# EAGLE design Sample (EAGLE 9.6.2)
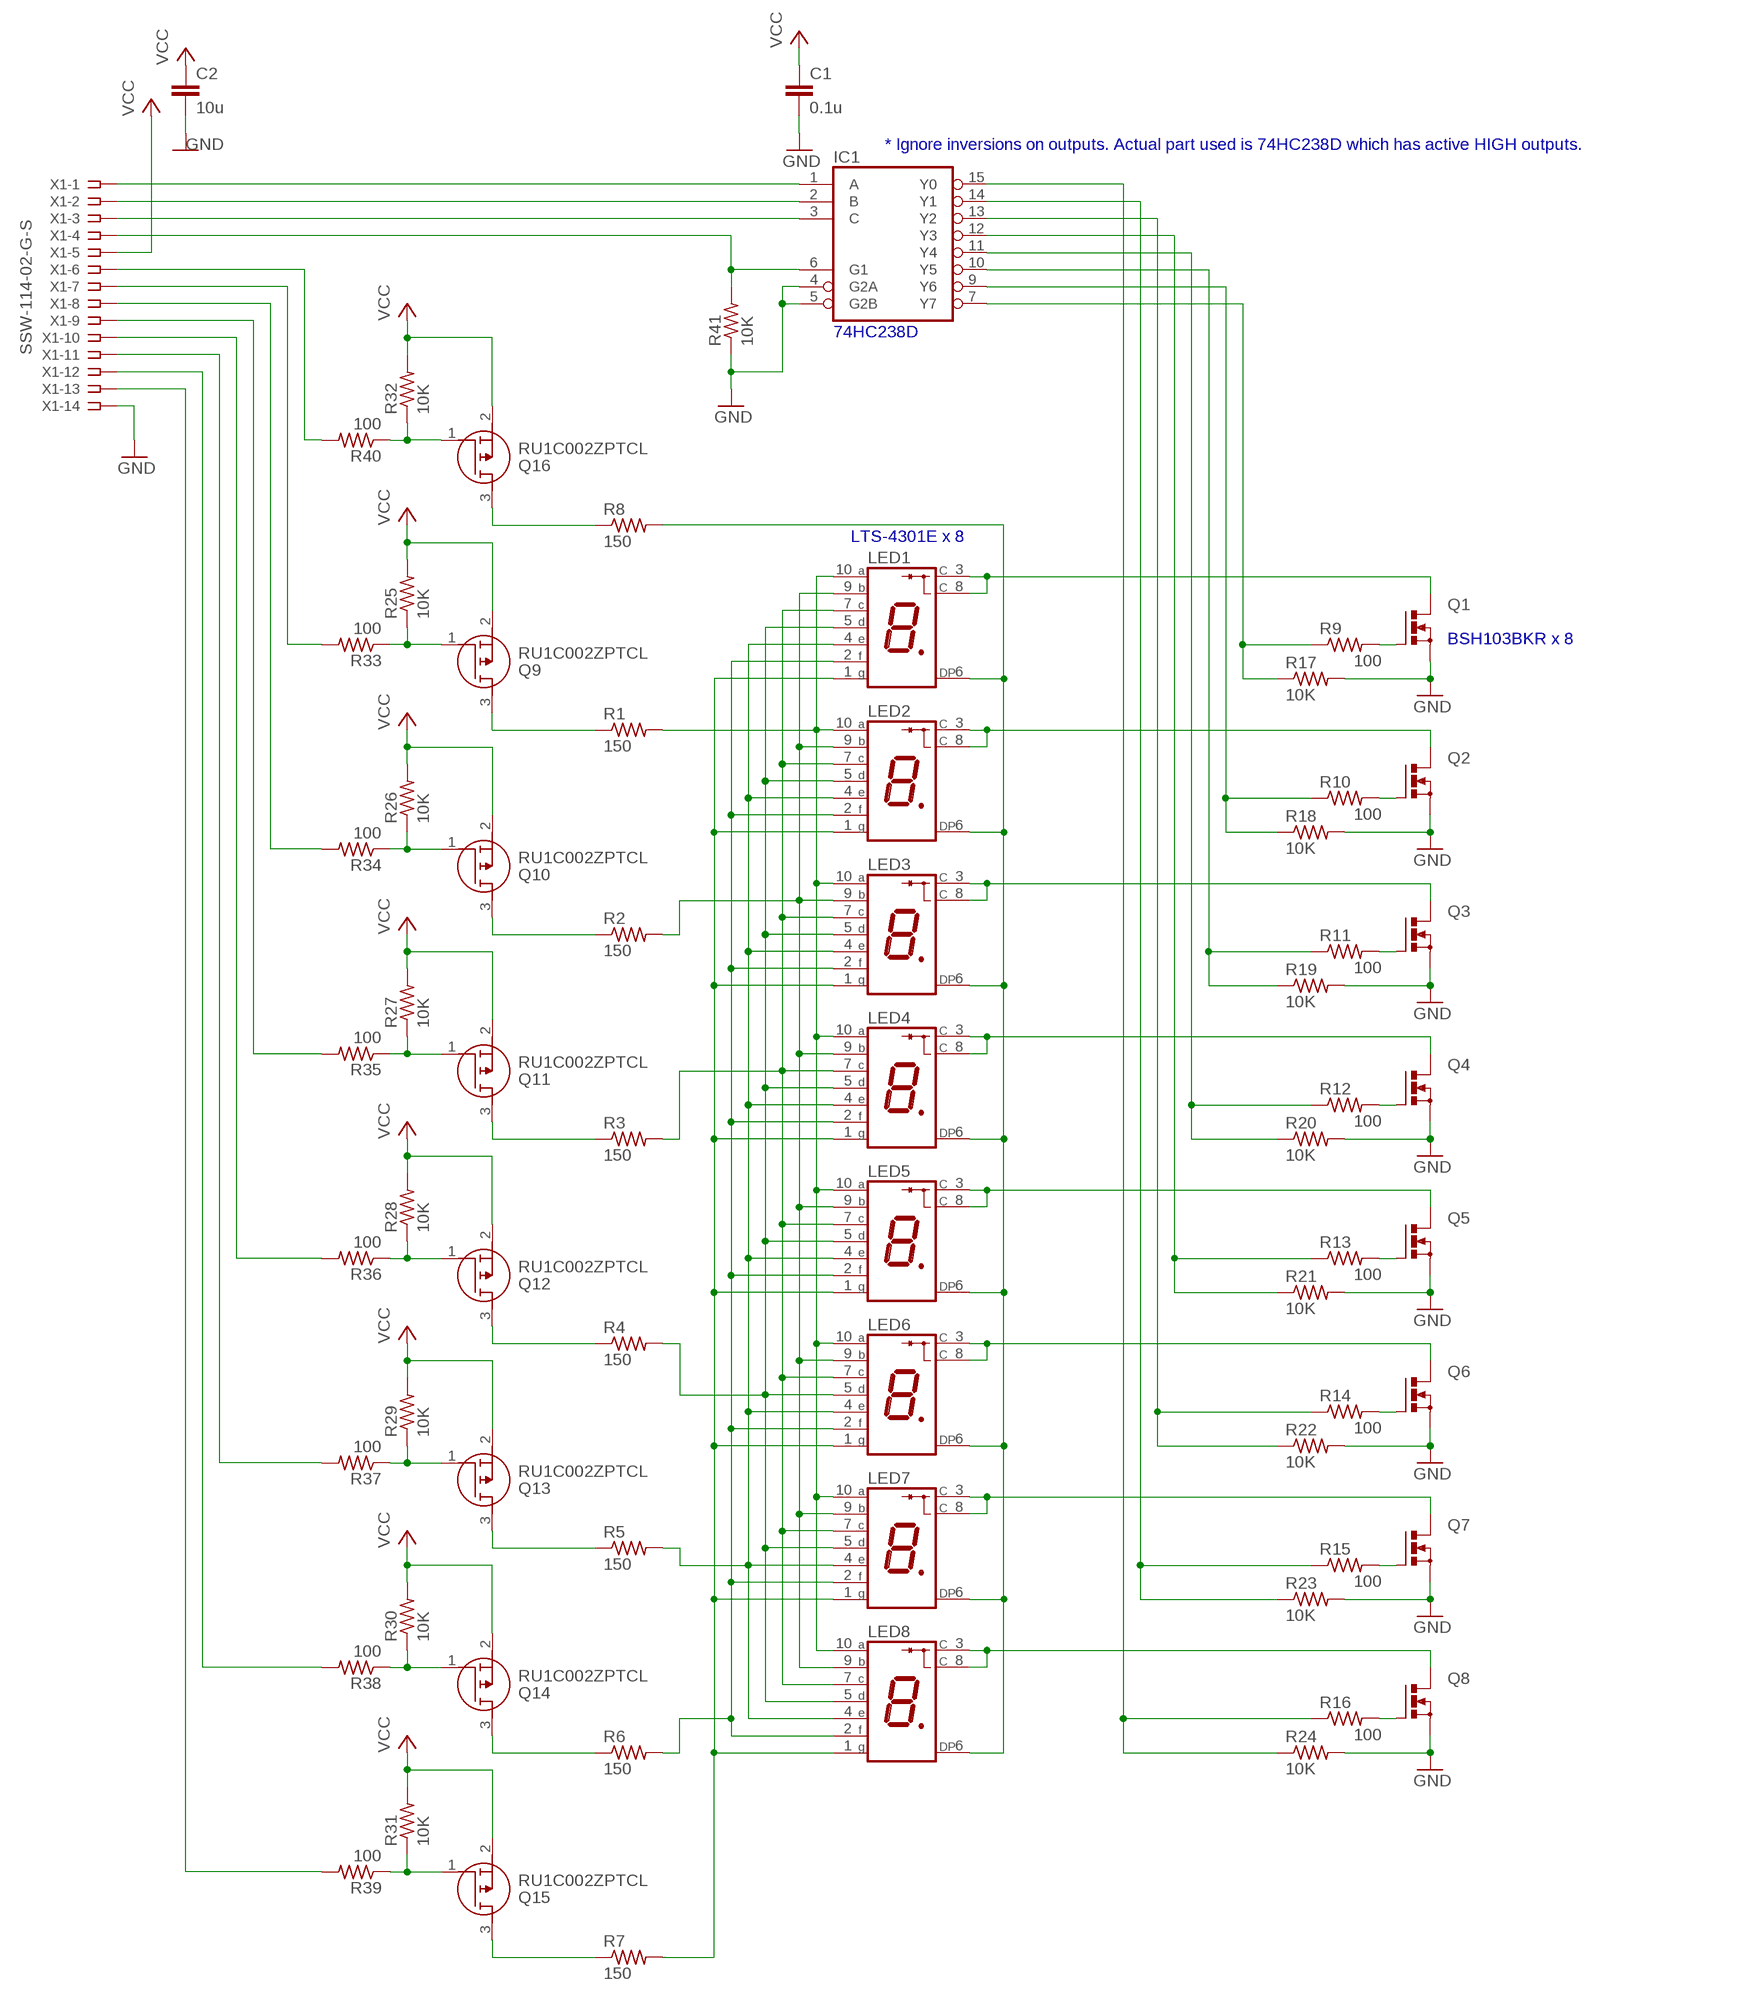
[diagram p0: schematic, sheet 1]

## Parts
C1  0.1u  C-EUC0805  [C0805]
C2  10u  C-EUC0805  [C0805]
IC1  74S138D  [SO16]
LED1  S4301B  [S4301B]
LED2  S4301B  [S4301B]
LED3  S4301B  [S4301B]
LED4  S4301B  [S4301B]
LED5  S4301B  [S4301B]
LED6  S4301B  [S4301B]
LED7  S4301B  [S4301B]
LED8  S4301B  [S4301B]
Q1  N-MOSFET-SO8  [SUPER-SOT3]
Q2  N-MOSFET-SO8  [SUPER-SOT3]
Q3  N-MOSFET-SO8  [SUPER-SOT3]
Q4  N-MOSFET-SO8  [SUPER-SOT3]
Q5  N-MOSFET-SO8  [SUPER-SOT3]
Q6  N-MOSFET-SO8  [SUPER-SOT3]
Q7  N-MOSFET-SO8  [SUPER-SOT3]
Q8  N-MOSFET-SO8  [SUPER-SOT3]
Q9  RU1C002ZPTCL  [SOTFL65P210X105-3N]
Q10  RU1C002ZPTCL  [SOTFL65P210X105-3N]
Q11  RU1C002ZPTCL  [SOTFL65P210X105-3N]
Q12  RU1C002ZPTCL  [SOTFL65P210X105-3N]
Q13  RU1C002ZPTCL  [SOTFL65P210X105-3N]
Q14  RU1C002ZPTCL  [SOTFL65P210X105-3N]
Q15  RU1C002ZPTCL  [SOTFL65P210X105-3N]
Q16  RU1C002ZPTCL  [SOTFL65P210X105-3N]
R1  150  R-US_R0805  [R0805]
R2  150  R-US_R0805  [R0805]
R3  150  R-US_R0805  [R0805]
R4  150  R-US_R0805  [R0805]
R5  150  R-US_R0805  [R0805]
R6  150  R-US_R0805  [R0805]
R7  150  R-US_R0805  [R0805]
R8  150  R-US_R0805  [R0805]
R9  100  R-US_R0805  [R0805]
R10  100  R-US_R0805  [R0805]
R11  100  R-US_R0805  [R0805]
R12  100  R-US_R0805  [R0805]
R13  100  R-US_R0805  [R0805]
R14  100  R-US_R0805  [R0805]
R15  100  R-US_R0805  [R0805]
R16  100  R-US_R0805  [R0805]
R17  10K  R-US_R0805  [R0805]
R18  10K  R-US_R0805  [R0805]
R19  10K  R-US_R0805  [R0805]
R20  10K  R-US_R0805  [R0805]
R21  10K  R-US_R0805  [R0805]
R22  10K  R-US_R0805  [R0805]
R23  10K  R-US_R0805  [R0805]
R24  10K  R-US_R0805  [R0805]
R25  10K  R-US_R0805  [R0805]
R26  10K  R-US_R0805  [R0805]
R27  10K  R-US_R0805  [R0805]
R28  10K  R-US_R0805  [R0805]
R29  10K  R-US_R0805  [R0805]
R30  10K  R-US_R0805  [R0805]
R31  10K  R-US_R0805  [R0805]
R32  10K  R-US_R0805  [R0805]
R33  100  R-US_R0805  [R0805]
R34  100  R-US_R0805  [R0805]
R35  100  R-US_R0805  [R0805]
R36  100  R-US_R0805  [R0805]
R37  100  R-US_R0805  [R0805]
R38  100  R-US_R0805  [R0805]
R39  100  R-US_R0805  [R0805]
R40  100  R-US_R0805  [R0805]
R41  10K  R-US_R0805  [R0805]
X1  SSW-114-02-G-S  [SSW-114-02-G-S]

## Nets
GND [LED_CURRENT]: C1.2 C2.2 IC1.4(G2A) IC1.5(G2B) Q1.2(S) Q2.2(S) Q3.2(S) Q4.2(S) Q5.2(S) Q6.2(S) Q7.2(S) Q8.2(S) R17.2 R18.2 R19.2 R20.2 R21.2 R22.2 R23.2 R24.2 R41.1 X1.14
LED_1_CATHODE [LED_CURRENT]: LED1.3(C) LED1.8(C) Q1.3(D)
LED_2_CATHODE [LED_CURRENT]: LED2.3(C) LED2.8(C) Q2.3(D)
LED_3_CATHODE [LED_CURRENT]: LED3.3(C) LED3.8(C) Q3.3(D)
LED_4_CATHODE [LED_CURRENT]: LED4.3(C) LED4.8(C) Q4.3(D)
LED_5_CATHODE [LED_CURRENT]: LED5.3(C) LED5.8(C) Q5.3(D)
LED_6_CATHODE [LED_CURRENT]: LED6.3(C) LED6.8(C) Q6.3(D)
LED_7_CATHODE [LED_CURRENT]: LED7.3(C) LED7.8(C) Q7.3(D)
LED_8_CATHODE [LED_CURRENT]: LED8.3(C) LED8.8(C) Q8.3(D)
N$1: Q1.1(G) R9.2
N$2: Q3.1(G) R11.2
N$3: Q5.1(G) R13.2
N$4: Q6.1(G) R14.2
N$5: Q7.1(G) R15.2
N$6: Q8.1(G) R16.2
N$7: Q2.1(G) R10.2
N$8: Q4.1(G) R12.2
N$9: IC1.6(G1) R41.2 X1.4
N$10: Q9.1(G) R25.1 R33.1
N$11: Q10.1(G) R26.1 R34.1
N$12: Q14.1(G) R30.1 R38.1
N$13: Q11.1(G) R27.1 R35.1
N$14: Q13.1(G) R29.1 R37.1
N$15: Q12.1(G) R28.1 R36.1
N$17: IC1.15(Y0) R16.1 R24.1
N$18: IC1.14(Y1) R15.1 R23.1
N$19: IC1.13(Y2) R14.1 R22.1
N$20: IC1.12(Y3) R13.1 R21.1
N$21: IC1.11(Y4) R12.1 R20.1
N$22: IC1.10(Y5) R11.1 R19.1
N$23: IC1.9(Y6) R10.1 R18.1
N$24: IC1.7(Y7) R9.1 R17.1
N$25: Q16.1(G) R32.1 R40.1
N$30: Q15.1(G) R31.1 R39.1
N$33: IC1.1(A) X1.1
N$34: IC1.2(B) X1.2
N$35: IC1.3(C) X1.3
N$37: R40.2 X1.6
N$38: R33.2 X1.7
N$39: R34.2 X1.8
N$40: R35.2 X1.9
N$41: R36.2 X1.10
N$42: R37.2 X1.11
N$43: R38.2 X1.12
N$44: R39.2 X1.13
SEGMENT_A_ANODE [LED_CURRENT]: LED1.10(A) LED2.10(A) LED3.10(A) LED4.10(A) LED5.10(A) LED6.10(A) LED7.10(A) LED8.10(A) R1.2
SEGMENT_A_DRAIN [LED_CURRENT]: Q9.3(D) R1.1
SEGMENT_B_ANODE [LED_CURRENT]: LED1.9(B) LED2.9(B) LED3.9(B) LED4.9(B) LED5.9(B) LED6.9(B) LED7.9(B) LED8.9(B) R2.2
SEGMENT_B_DRAIN [LED_CURRENT]: Q10.3(D) R2.1
SEGMENT_C_ANODE [LED_CURRENT]: LED1.7(C) LED2.7(C) LED3.7(C) LED4.7(C) LED5.7(C) LED6.7(C) LED7.7(C) LED8.7(C) R3.2
SEGMENT_C_DRAIN [LED_CURRENT]: Q11.3(D) R3.1
SEGMENT_D_ANODE [LED_CURRENT]: LED1.5(D) LED2.5(D) LED3.5(D) LED4.5(D) LED5.5(D) LED6.5(D) LED7.5(D) LED8.5(D) R4.2
SEGMENT_D_DRAIN [LED_CURRENT]: Q12.3(D) R4.1
SEGMENT_DP_ANODE [LED_CURRENT]: LED1.6(DP) LED2.6(DP) LED3.6(DP) LED4.6(DP) LED5.6(DP) LED6.6(DP) LED7.6(DP) LED8.6(DP) R8.2
SEGMENT_DP_DRAIN [LED_CURRENT]: Q16.3(D) R8.1
SEGMENT_E_ANODE [LED_CURRENT]: LED1.4(E) LED2.4(E) LED3.4(E) LED4.4(E) LED5.4(E) LED6.4(E) LED7.4(E) LED8.4(E) R5.2
SEGMENT_E_DRAIN [LED_CURRENT]: Q13.3(D) R5.1
SEGMENT_F_ANODE [LED_CURRENT]: LED1.2(F) LED2.2(F) LED3.2(F) LED4.2(F) LED5.2(F) LED6.2(F) LED7.2(F) LED8.2(F) R6.2
SEGMENT_F_DRAIN [LED_CURRENT]: Q14.3(D) R6.1
SEGMENT_G_ANODE [LED_CURRENT]: LED1.1(G) LED2.1(G) LED3.1(G) LED4.1(G) LED5.1(G) LED6.1(G) LED7.1(G) LED8.1(G) R7.2
SEGMENT_G_DRAIN [LED_CURRENT]: Q15.3(D) R7.1
VCC: C1.1 C2.1 Q9.2(S) Q10.2(S) Q11.2(S) Q12.2(S) Q13.2(S) Q14.2(S) Q15.2(S) Q16.2(S) R25.2 R26.2 R27.2 R28.2 R29.2 R30.2 R31.2 R32.2 X1.5

## Notes on the sheet
- * Ignore inversions on outputs. Actual part used is 74HC238D which has active HIGH outputs.
- 74HC238D
- LTS-4301E x 8
- BSH103BKR x 8

## Power pins joined to a net without a drawn wire
GND: IC1.8(GND)
VCC: IC1.16(VCC)

## Library data of the parts
C1 C2 = rcl:C-EU: CAPACITOR, European symbol; SPICEPREFIX: C
IC1 = 74xx-us:74*138: 3-line to 8-line DECODER/DEMULTIPLEXER
LED1-LED8 = led-7-segment:S4301B: Single Digit Seven-Segment Display (cathode common) Source: LITEON .. S4301B.pdf; OC_FARNELL: unknown; OC_NEWARK: unknown
Q1-Q8 = transistor-power:N-MOSFET-SO8: N-Channel MOSFET Example: FDS7760A; N-Channel Logic Level PowerTrench® MOSFET FDS2572; N-Channel UltraFET® Trench MOSFET Source: www.fairchildsemi.com
Q9-Q16 = SamacSys_Parts:RU1C002ZPTCL: ROHM - RU1C002ZPTCL - MOSFET, P-CH, -20V, -0.2A, SOT-323FL Source: Datasheet <https://datasheet.datasheetarchive.com/originals/distributors/DKDS-18/357035.pdf>; DESCRIPTION: ROHM - RU1C002ZPTCL - MOSFET, P-CH, -20V, -0.2A, SOT-323FL; HEIGHT: 1.05mm; MANUFACTURER_NAME: ROHM Semiconductor; MANUFACTURER_PART_NUMBER: RU1C002ZPTCL; MOUSER_PART_NUMBER: 755-RU1C002ZPTCL; MOUSER_PRICE-STOCK: https://www.mouser.co.uk/ProductDetail/ROHM-Semiconductor/RU1C002ZPTCL?qs=npTsUczJOtPjN7gylmvn7g%3D%3D
R1-R41 = rcl:R-US_: RESISTOR, American symbol; SPICEPREFIX: R
X1 = con-samtec:SSW-114-02-G-S: THROUGH-HOLE .025" SQ POST SOCKET Source: Samtec SSW.pdf; MF: Samtec Inc.; MPN: SSW-114-02-G-S; OC_FARNELL: unknown; OC_NEWARK: 11P9549

## Net classes
0 default: width 0.254 mm, drill 0.254 mm, clearance 0.254 mm
1 LED_CURRENT: width 0.305 mm, drill 0.254 mm, clearance 0.305 mm

## Board
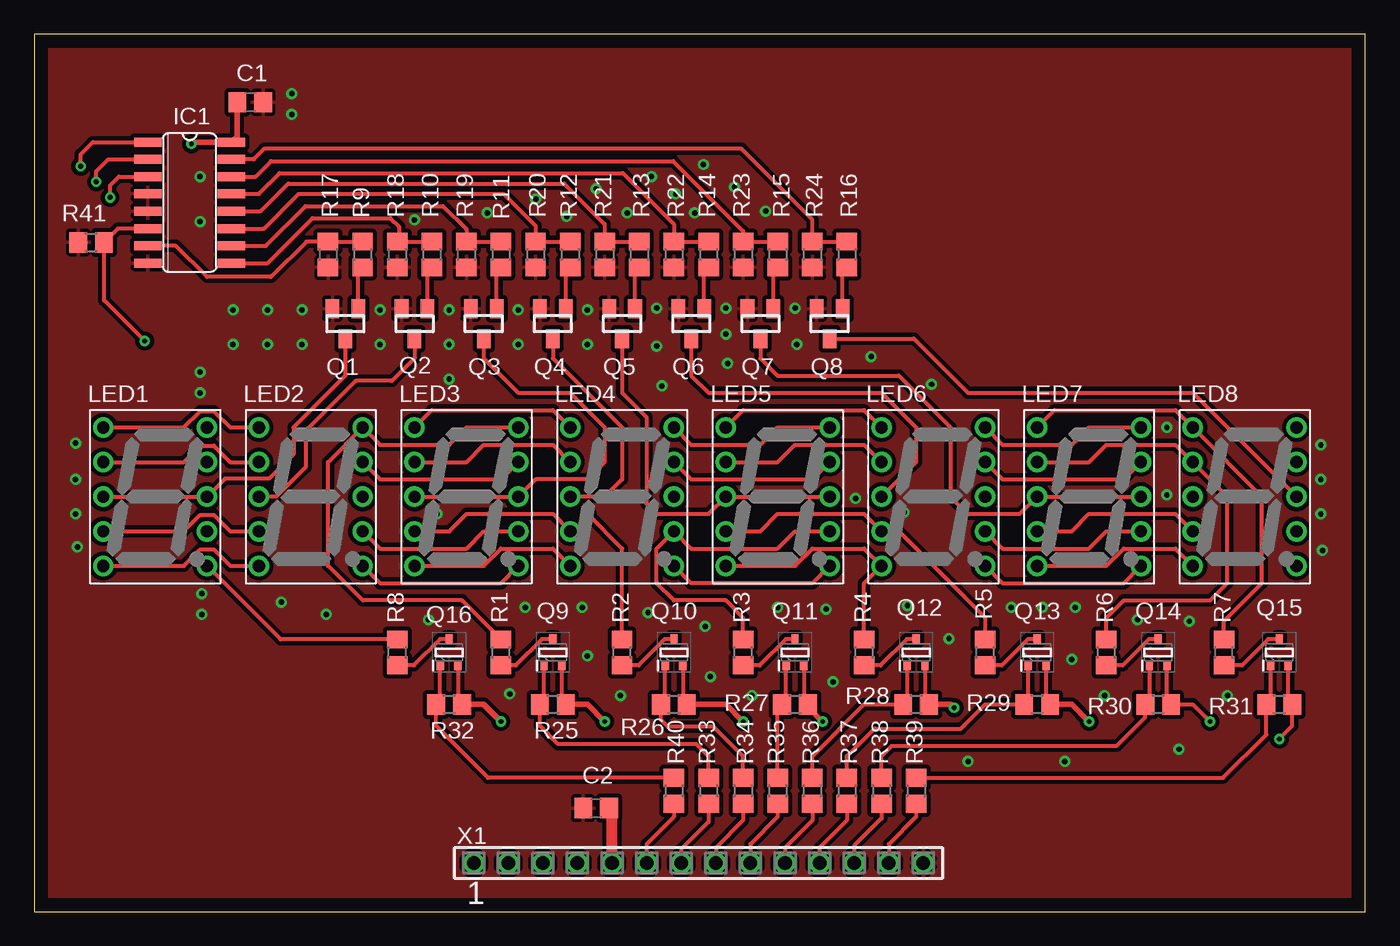
[diagram p1: board, top side]
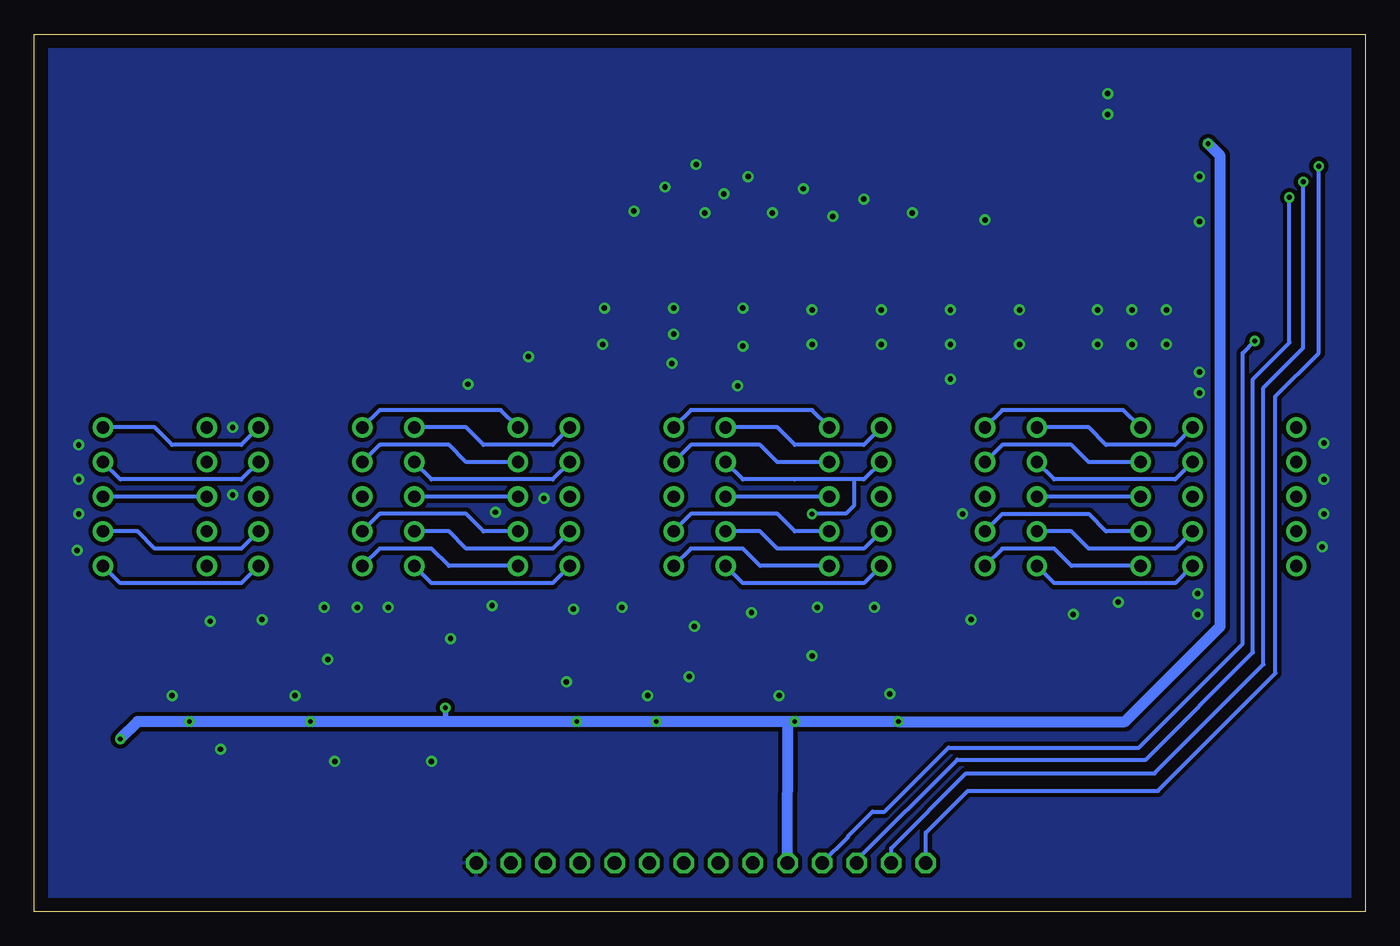
[diagram p2: board, bottom side, seen from below]

Size 97.77 x 64.44 mm. Coordinates in mm from the lower left corner, seen from the top.
Outline: 0,0 97.77,0 97.77,64.44 0,64.44 0,0
Copper layers (1*16): Top 0.035mm / dielectric 1.5mm / Bottom 0.035mm
Design rules "default": minimum track width 6mil, minimum drill 0.35mm, track to track 6mil, track to pad 6mil, pad to pad 6mil, via to via 6mil, smd to smd 6mil, copper to edge 40mil, drill to drill 6mil, minimum pad ring 10mil, minimum via ring 8mil, stop-mask expansion 4mil, vias tented up to drill 0mil, thermal gap 10mil

### Footprints (pad centres in the part's own frame; a part is rotated, then mirrored left to right if it is on the bottom)
C0805 = smd 1.3 x 1.5: 1 -0.95,0; 2 0.95,0
SO16 = smd 0.66 x 2.032: 1 -4.445,-3.073; 2 -3.175,-3.073; 3 -1.905,-3.073; 4 -0.635,-3.073; 5 0.635,-3.073; 6 1.905,-3.073; 7 3.175,-3.073; 8 4.445,-3.073; 9 4.445,3.073; 10 3.175,3.073; 11 1.905,3.073; 12 0.635,3.073; 13 -0.635,3.073; 14 -1.905,3.073; 15 -3.175,3.073; 16 -4.445,3.073
S4301B = drill 0.9 pad 1.5: 1 -3.81,5.08; 2 -3.81,2.54; 3 -3.81,0; 4 -3.81,-2.54; 5 -3.81,-5.08; 6 3.81,-5.08; 7 3.81,-2.54; 8 3.81,0; 9 3.81,2.54; 10 3.81,5.08
SUPER-SOT3 = smd 1 x 1.4: 1 -0.95,-1.1; 2 0.95,-1.1; 3 0,1.1
SOTFL65P210X105-3N = smd 0.695 x 0.54: 1 -0.972,0.65; 2 -0.972,-0.65; 3 0.972,0
R0805 = smd 1.3 x 1.5: 1 -0.95,0; 2 0.95,0
SSW-114-02-G-S = drill 1 pad 1.5 octagon: 1 -16.51,0; 2 -13.97,0; 3 -11.43,0; 4 -8.89,0; 5 -6.35,0; 6 -3.81,0; 7 -1.27,0; 8 1.27,0; 9 3.81,0; 10 6.35,0; 11 8.89,0; 12 11.43,0; 13 13.97,0; 14 16.51,0

### Placement (x,y rotation side)
C1  15.88,59.44 0 top
C2  41.27,7.62 180 top
IC1  11.43,52.07 270 top
LED1  8.89,30.48 0 top
LED2  20.32,30.48 0 top
LED3  31.75,30.48 0 top
LED4  43.18,30.48 0 top
LED5  54.61,30.48 0 top
LED6  66.04,30.48 0 top
LED7  77.47,30.48 0 top
LED8  88.9,30.48 0 top
Q1  22.86,43.18 180 top
Q2  27.94,43.18 180 top
Q3  33.02,43.18 180 top
Q4  38.1,43.18 180 top
Q5  43.18,43.18 180 top
Q6  48.26,43.18 180 top
Q7  53.34,43.18 180 top
Q8  58.42,43.18 180 top
Q9  38.1,19.05 90 top
Q10  46.99,19.05 90 top
Q11  55.88,19.05 90 top
Q12  64.77,19.05 90 top
Q13  73.66,19.05 90 top
Q14  82.55,19.05 90 top
Q15  91.44,19.05 90 top
Q16  30.48,19.05 90 top
R1  34.29,19.05 90 top
R2  43.18,19.05 90 top
R3  52.07,19.05 90 top
R4  60.96,19.05 90 top
R5  69.85,19.05 90 top
R6  78.74,19.05 90 top
R7  87.38,19.05 90 top
R8  26.67,19.05 90 top
R9  24.13,48.26 270 top
R10  29.21,48.26 270 top
R11  34.29,48.26 270 top
R12  39.37,48.26 270 top
R13  44.45,48.26 270 top
R14  49.53,48.26 270 top
R15  54.61,48.26 270 top
R16  59.69,48.26 270 top
R17  21.59,48.26 270 top
R18  26.67,48.26 270 top
R19  31.75,48.26 270 top
R20  36.83,48.26 270 top
R21  41.91,48.26 270 top
R22  46.99,48.26 270 top
R23  52.07,48.26 270 top
R24  57.15,48.26 270 top
R25  38.1,15.24 0 top
R26  46.99,15.24 0 top
R27  55.88,15.24 0 top
R28  64.77,15.24 0 top
R29  73.66,15.24 0 top
R30  82.55,15.24 0 top
R31  91.44,15.24 0 top
R32  30.48,15.24 0 top
R33  49.53,8.89 270 top
R34  52.07,8.89 270 top
R35  54.61,8.89 270 top
R36  57.15,8.89 270 top
R37  59.69,8.89 270 top
R38  62.23,8.89 270 top
R39  64.77,8.89 270 top
R40  46.99,8.89 270 top
R41  4.19,49.15 0 top
X1  48.79,3.59 0 top

### Tracks (layer width: path | path; a pad name or v marks a point on that pad's centre or on a via)
GND  (via drill 0.4)
  other vias: 25.4,44.2 19.68,44.2 19.68,41.66 17.14,41.66 17.14,44.2 14.61,44.2 14.61,41.66 25.4,41.66 30.48,44.2 30.48,41.66 30.48,39.12 35.56,44.2 35.56,41.66 40.64,44.2 40.64,41.66 45.09,21.97 49.28,20.95 49.66,17.27 52.7,15.88 45.72,44.32 45.72,41.53 46.1,38.61 50.8,44.32 50.8,42.42 50.93,40.26 63.88,29.34 71.75,22.35 74.04,22.35 76.45,22.35 76.2,18.54 78.61,15.88 55.88,44.32 56.01,41.66 61.47,40.77 65.91,38.73 27.94,50.8 33.27,51.31 36.83,52.32 39.12,51.05 41.27,53.09 43.56,51.31 45.34,53.98 47.12,52.7 48.51,51.31 49.15,54.86 51.44,53.21 53.72,51.44 12.32,23.37 12.32,21.84 12.19,38.1 12.19,39.62 3.17,26.8 3.05,29.21 3.05,31.75 3.05,34.42 94.49,34.29 94.49,31.75 94.49,29.21 94.61,26.54 18.92,60.07 18.92,58.55 18.16,22.73 21.46,21.84 36.07,22.35 40.26,22.35 40.64,18.8 43.05,15.88 28.96,21.46 34.92,16 54.61,22.35 58.17,22.23 58.67,16.89 64.14,22.48 67.18,20.07 81.03,21.46 84.84,21.34 87.63,15.88 84.07,11.94 75.69,11.05 68.58,11.05 29.59,29.21 60.33,30.35 83.19,30.61 83.19,35.56 12.19,53.98 12.19,50.67
  pour Top: 0,63.5 0,64.77 97.79,64.77 97.79,0 0,0
  pour Bottom: 0,0 0,64.77 97.79,64.77 97.79,0
LED_1_CATHODE
  Top 0.305: LED1.3 LED1.8 14.03,31.81 17.26,31.81 19.05,33.6 19.05,35.56 22.86,39.37 Q1.3
LED_2_CATHODE
  Top 0.305: Q2.3 27.94,40.64 26.29,38.99 23.62,38.99 19.94,35.31 19.94,32.64 17.78,30.48 LED2.3
  Bottom 0.305: LED2.3 LED2.8
LED_3_CATHODE
  Top 0.305: LED3.3 LED3.8 36.83,31.75 40.64,31.75 41.91,33.02 41.91,35.56 39.37,38.1 35.56,38.1 33.02,40.64 Q3.3 33.19,41.91
LED_4_CATHODE
  Top 0.305: 38.27,41.91 Q4.3 38.1,40.64 43.18,35.56 43.18,31.75 41.91,30.48 LED4.3
  Bottom 0.305: LED4.3 LED4.8
LED_5_CATHODE
  Top 0.305: LED5.8 LED5.3 49.53,29.21 45.72,29.21 44.96,29.97 44.96,36.32 43.18,38.1 Q5.3
LED_6_CATHODE
  Top 0.305: Q6.3 48.26,39.37 49.53,38.1 62.23,38.1 64.77,35.56 64.77,33.02 LED6.3
  Bottom 0.305: LED6.3 LED6.8
LED_7_CATHODE
  Top 0.305: LED7.8 LED7.3 72.39,29.21 68.58,29.21 67.31,30.48 67.31,35.56 63.5,39.37 54.61,39.37 53.34,40.64 Q7.3
LED_8_CATHODE
  Top 0.305: Q8.3 64.6,42.08 68.58,38.1 85.09,38.1 LED8.8
  Bottom 0.305: LED8.3 LED8.8
N$1
  Top 0.305: Q1.1 23.81,46.99 R9.2
N$2
  Top 0.305: Q3.1 33.97,46.99 R11.2
N$3
  Top 0.305: Q5.1 44.13,46.99 R13.2
N$4
  Top 0.305: Q6.1 49.21,46.99 R14.2
N$5
  Top 0.305: Q7.1 54.29,46.99 R15.2
N$6
  Top 0.305: Q8.1 59.37,46.99 R16.2
N$7
  Top 0.305: Q2.1 28.89,46.99 R10.2
N$8
  Top 0.305: Q4.1 39.05,46.99 R12.2
N$9  (via drill 0.35)
  Top 0.305: v8.13,41.91 5.14,44.9 R41.2 6.16,50.16 IC1.6
  Bottom 0.305: X1.4 37.97,5.52 37.97,5.59 36.2,7.37 35.31,7.37 30.61,12.06 16.64,12.06 9.02,19.68 9.02,41.02 v8.13,41.91
N$10
  Top 0.305: 37.15,14.92 R25.1 | R33.1 49.53,11.43 48.64,12.32 38.48,12.32 37.15,13.65 R25.1 | R25.1 37.45,15.54 Q9.1
N$11
  Top 0.305: R34.1 52.07,11.43 49.91,13.59 46.54,13.59 46.04,14.09 R26.1 46.34,15.54 Q10.1
N$12
  Top 0.305: R38.1 62.23,11.43 62.99,12.19 79.5,12.19 81.6,14.29 R30.1 81.9,15.54 Q14.1
N$13
  Top 0.305: R35.1 54.61,14.92 R27.1 55.23,15.54 Q11.1
N$14
  Top 0.305: R37.1 59.69,11.43 61.72,13.46 68.07,13.46 69.85,15.24 R29.1 73.01,15.54 Q13.1
N$15
  Top 0.305: R36.1 57.15,11.43 60.96,15.24 R28.1 64.12,15.54 Q12.1
N$17
  Top 0.305: R16.1 R24.1 57.15,50.8 51.94,56.01 16.89,56.01 16.13,55.24 IC1.15
N$18
  Top 0.305: R15.1 R23.1 52.07,49.97 46.92,55.12 17.4,55.12 16.26,53.98 IC1.14
N$19
  Top 0.305: R14.1 R22.1 46.99,50.48 43.24,54.23 18.03,54.23 16.51,52.7 IC1.13
N$20
  Top 0.305: R13.1 R21.1 41.91,50.48 38.92,53.47 18.67,53.47 16.64,51.44 IC1.12
N$21
  Top 0.305: R12.1 R20.1 36.83,50.35 34.48,52.7 19.43,52.7 16.89,50.16 IC1.11
N$22
  Top 0.305: R11.1 R19.1 31.75,50.1 30.03,51.82 19.94,51.82 17.02,48.9 IC1.10
N$23
  Top 0.305: R18.1 26.8,49.21 | 26.8,49.21 R10.1 | IC1.9 17.14,47.62 20.45,50.93 26.16,50.93 26.8,50.29 26.8,49.21
N$24
  Top 0.305: R9.1 R17.1 20,49.21 17.4,46.61 12.7,46.61 10.41,48.9 IC1.7
N$25
  Top 0.305: R40.1 33.34,9.84 29.53,13.65 R32.1 29.83,15.54 Q16.1
N$30
  Top 0.305: R39.1 87.31,9.84 90.49,13.02 R31.1 90.79,15.54 Q15.1
N$33  (via drill 0.35)
  Top 0.305: v3.43,54.74 3.43,55.63 4.32,56.52 IC1.1
  Bottom 0.305: X1.1 32.28,5.82 29.21,8.89 15.24,8.89 6.6,17.53 6.6,37.85 3.43,41.02 v3.43,54.74
N$34  (via drill 0.35)
  Top 0.305: v4.57,53.59 4.57,54.36 5.46,55.24 IC1.2
  Bottom 0.305: X1.2 34.82,4.68 29.34,10.16 15.49,10.16 7.49,18.16 7.49,38.48 4.57,41.4 v4.57,53.59
N$35  (via drill 0.35)
  Top 0.305: v5.59,52.45 5.59,53.34 6.22,53.98 IC1.3
  Bottom 0.305: X1.3 37.36,3.79 29.97,11.18 16.13,11.18 8.26,19.05 8.26,39.12 5.59,41.78 v5.59,52.45
N$37
  Top 0.305: R40.2 46.99,6.99 44.98,4.98 X1.6
N$38
  Top 0.305: R33.2 49.53,6.6 47.52,4.59 X1.7
N$39
  Top 0.305: R34.2 52.07,6.73 50.06,4.72 X1.8
N$40
  Top 0.305: R35.2 54.61,6.99 52.6,4.98 X1.9
N$41
  Top 0.305: R36.2 57.15,6.73 55.14,4.72 X1.10
N$42
  Top 0.305: R37.2 59.69,6.73 57.68,4.72 X1.11
N$43
  Top 0.305: R38.2 62.23,6.86 60.22,4.85 X1.12
N$44
  Top 0.305: R39.2 64.77,6.99 62.76,4.98 X1.13
SEGMENT_A_ANODE
  Top 0.305: LED3.10 31.75,35.56 30.48,34.29 25.4,34.29 LED2.10 21.59,33.02 21.59,25.4 24.13,22.86 31.43,22.86 R1.2 | LED4.10 48.26,34.29 53.34,34.29 54.61,35.56 LED5.10 | LED6.10 71.12,34.29 76.2,34.29 77.47,35.56 LED7.10
  Bottom 0.305: LED1.10 13.97,34.29 19.05,34.29 20.32,35.56 LED2.10 | LED3.10 36.83,34.29 41.91,34.29 43.18,35.56 LED4.10 | LED5.10 59.69,34.29 64.77,34.29 66.04,35.56 LED6.10 | LED7.10 82.55,34.29 87.63,34.29 88.9,35.56 LED8.10
SEGMENT_A_DRAIN
  Top 0.305: Q9.3 37.29,20.02 35.37,18.1 R1.1
SEGMENT_B_ANODE  (via drill 0.35)
  Top 0.305: LED2.9 25.4,31.75 34.29,31.75 LED3.9 | LED4.9 48.26,31.75 57.15,31.75 LED5.9 | LED6.9 71.12,31.75 80.01,31.75 LED7.9 | v40.64,29.21 43.18,26.67 R2.2
  Bottom 0.305: LED1.9 13.97,31.75 22.86,31.75 LED2.9 | LED3.9 36.83,31.75 37.53,31.75 | LED4.9 45.72,31.75 41.91,31.75 | LED5.9 59.69,31.75 68.58,31.75 LED6.9 | LED7.9 82.55,31.75 91.44,31.75 LED8.9 | v40.64,29.21 40.58,29.27 38.11,29.27 37.53,29.85 37.53,31.75 | 37.53,31.75 41.91,31.75 | 41.91,31.75
SEGMENT_B_DRAIN
  Top 0.305: Q10.3 46.31,20.02 44.39,18.1 R2.1
SEGMENT_C_ANODE
  Top 0.305: LED2.7 25.4,26.67 31.75,26.67 33.02,27.94 LED3.7 | LED5.7 55.88,27.94 54.61,26.67 48.26,26.67 LED4.7 45.72,26.67 45.72,24.13 46.99,22.86 50.8,22.86 52.07,21.59 R3.2 | LED6.7 71.12,26.67 77.47,26.67 78.74,27.94 LED7.7
  Bottom 0.305: LED1.7 13.97,26.67 20.32,26.67 21.59,27.94 LED2.7 | LED3.7 36.83,26.67 43.18,26.67 44.45,27.94 LED4.7 | LED5.7 59.69,26.67 66.04,26.67 67.31,27.94 LED6.7 | LED7.7 82.55,26.67 88.9,26.67 90.17,27.94 LED8.7
SEGMENT_C_DRAIN
  Top 0.305: Q11.3 55.2,20.02 53.28,18.1 R3.1
SEGMENT_D_ANODE
  Top 0.305: LED1.5 10.99,25.4 12.2,26.61 13.2,26.61 14.41,25.4 LED2.5 | LED3.5 33.02,25.4 34.29,26.67 38.1,26.67 LED4.5 | LED5.5 55.88,25.4 57.15,26.67 60.96,26.67 LED6.5 60.96,24.13 R4.2 | LED7.5 78.74,25.4 80.01,26.67 83.82,26.67 LED8.5
  Bottom 0.305: LED2.5 21.59,25.4 22.86,26.67 26.67,26.67 LED3.5 | LED4.5 44.45,25.4 45.72,26.67 49.53,26.67 LED5.5 | LED6.5 67.31,25.4 68.58,26.67 72.39,26.67 LED7.5
SEGMENT_D_DRAIN
  Top 0.305: Q12.3 64.09,20.02 62.17,18.1 R4.1
SEGMENT_DP_ANODE
  Top 0.305: LED2.6 25.4,24.13 34.29,24.13 LED3.6 | LED5.6 57.15,24.13 48.26,24.13 LED4.6 | LED6.6 71.12,24.13 80.01,24.13 LED7.6 | R8.2 18.1,20 LED1.6
  Bottom 0.305: LED1.6 13.97,24.13 22.86,24.13 LED2.6 | LED3.6 36.83,24.13 45.72,24.13 LED4.6 | LED5.6 59.69,24.13 68.58,24.13 LED6.6 | LED7.6 82.55,24.13 91.44,24.13 LED8.6
SEGMENT_DP_DRAIN
  Top 0.305: Q16.3 29.8,20.02 27.88,18.1 R8.1
SEGMENT_E_ANODE
  Top 0.305: LED1.4 10.99,27.94 12.2,29.15 13.2,29.15 14.41,27.94 LED2.4 | LED3.4 30.48,27.94 31.75,29.21 38.1,29.21 LED4.4 | LED5.4 53.34,27.94 54.61,29.21 60.96,29.21 LED6.4 63.5,27.94 69.85,21.59 R5.2 69.85,20.32 | LED7.4 76.2,27.94 77.47,29.21 83.82,29.21 LED8.4
  Bottom 0.305: LED2.4 19.05,27.94 20.32,29.21 26.67,29.21 LED3.4 | LED4.4 41.91,27.94 43.18,29.21 49.53,29.21 LED5.4 | LED6.4 64.77,27.94 66.04,29.21 72.39,29.21 LED7.4
SEGMENT_E_DRAIN
  Top 0.305: Q13.3 72.98,20.02 71.06,18.1 R5.1
SEGMENT_F_ANODE
  Top 0.305: LED1.2 10.99,33.02 12.2,34.23 13.2,34.23 14.41,33.02 LED2.2 | LED3.2 31.75,33.02 33.02,34.29 38.1,34.29 LED4.2 | LED5.2 54.61,33.02 55.88,34.29 60.96,34.29 LED6.2 | LED7.2 77.47,33.02 78.74,34.29 83.82,34.29 LED8.2 87.63,30.48 87.63,24.13 86.36,22.86 80.01,22.86 78.74,21.59 R6.2
  Bottom 0.305: LED2.2 20.32,33.02 21.59,34.29 26.67,34.29 LED3.2 | LED4.2 43.18,33.02 44.45,34.29 49.53,34.29 LED5.2 | LED6.2 66.04,33.02 67.31,34.29 72.39,34.29 LED7.2
SEGMENT_F_DRAIN
  Top 0.305: Q14.3 81.87,20.02 79.95,18.1 R6.1
SEGMENT_G_ANODE
  Top 0.305: LED1.1 10.99,35.56 12.2,36.77 13.2,36.77 14.41,35.56 LED2.1 | LED3.1 29.21,36.83 38.1,36.83 LED4.1 | LED5.1 52.07,36.83 60.96,36.83 LED6.1 | LED7.1 74.93,36.83 83.82,36.83 LED8.1 90.17,30.48 90.17,24.13 87.38,21.34 R7.2 87.38,20.07
  Bottom 0.305: LED2.1 17.78,36.83 26.67,36.83 LED3.1 | LED4.1 40.64,36.83 49.53,36.83 LED5.1 | LED6.1 63.5,36.83 72.39,36.83 LED7.1
SEGMENT_G_DRAIN
  Top 0.305: Q15.3 90.63,20.02 88.71,18.1 R7.1
VCC  (via drill 0.35)
  Top 0.305: Q14.2 83.2,15.54 R30.2 85.09,15.24 v86.36,13.97 | Q15.2 92.09,15.54 R31.2 92.39,13.65 v91.44,12.7 | Q13.2 74.31,15.54 R29.2 | Q12.2 65.42,15.54 R28.2 | Q11.2 56.53,15.54 R27.2 | Q10.2 47.64,15.54 R26.2 | Q9.2 38.75,15.54 R25.2 | Q16.2 31.13,15.54 R32.2
  Top 0.406: R32.2 33.02,15.24 v34.29,13.97 | R25.2 40.64,15.24 v41.91,13.97 | R26.2 50.8,15.24 v52.07,13.97 | R27.2 56.83,15.05 v57.91,13.97 | R28.2 67.31,15.24 v67.56,14.99 | R29.2 76.2,15.24 v77.47,13.97 | v11.56,56.39 11.68,56.52 IC1.16 14.93,56.94 C1.1
  Top 0.813: X1.5 42.44,7.4 C2.1
  Bottom 0.406: v67.56,14.99 67.56,14.22 67.31,13.97
  Bottom 0.813: 42.42,13.97 v41.91,13.97 v34.29,13.97 17.65,13.97 10.67,20.95 10.67,55.5 v11.56,56.39 | 42.42,13.97 v52.07,13.97 v57.91,13.97 67.31,13.97 v77.47,13.97 v86.36,13.97 90.17,13.97 v91.44,12.7 | X1.5 42.42,13.97